# EAGLE design DTUnodeSchematic (EAGLE 8.0.0)

## Sheet 1 of 4
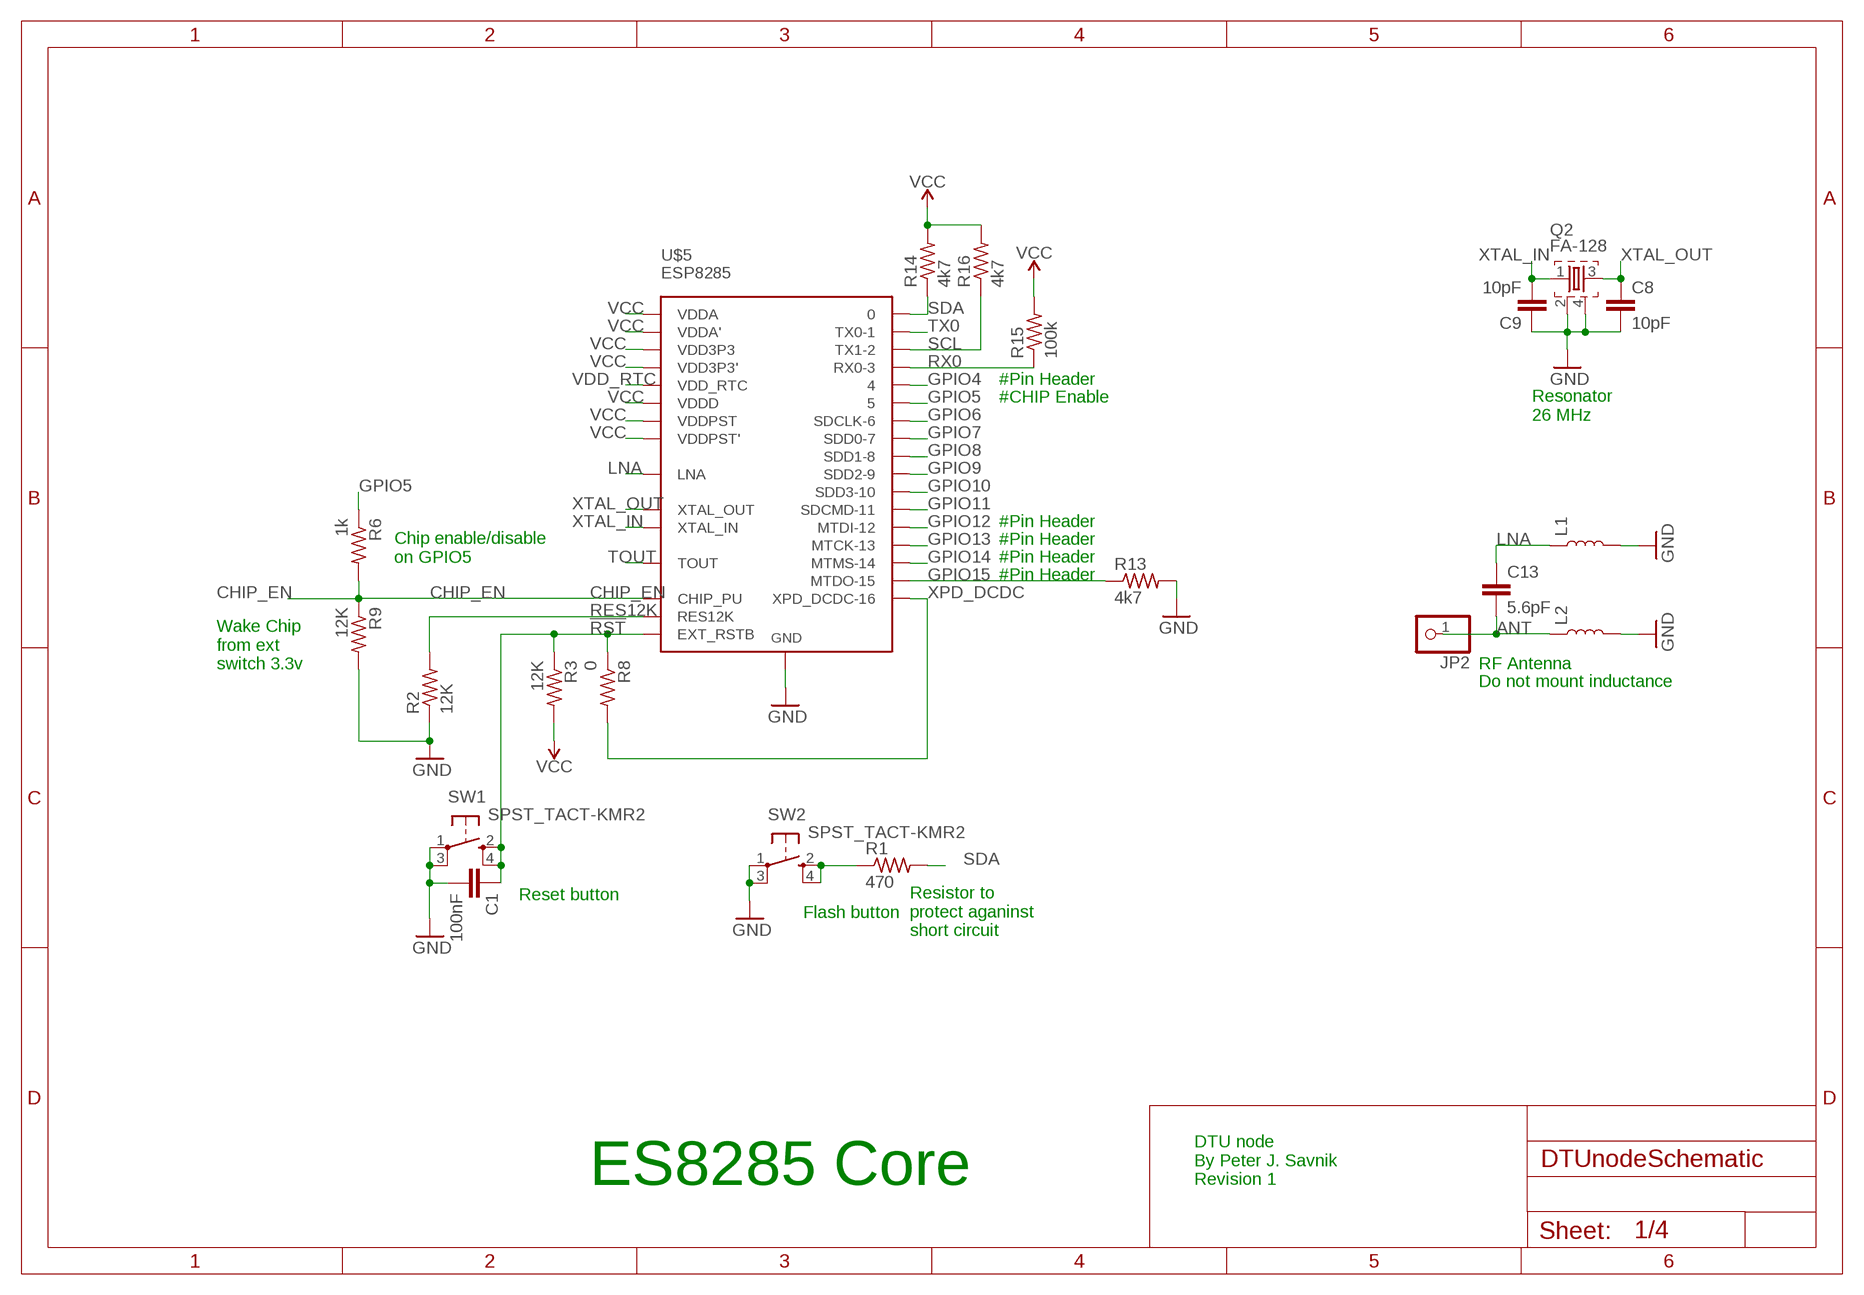
[diagram p0: schematic, sheet 1]

### Parts
C1  100nF  C-EUC0402K  [C0402K]
C8  10pF  C-EUC0402K  [C0402K]
C9  10pF  C-EUC0402K  [C0402K]
C13  5.6pF  C-EUC0402K  [C0402K]
JP2  PINHD-1X1  [1X01]
L1  INDUCTOR-0402-3.9NH  [0402]
L2  INDUCTOR-0402-3.9NH  [0402]
Q2  FA-128  [FA-128]
R1  470  R-US_R0402  [R0402]
R2  12K  R-US_R0402  [R0402]
R3  12K  R-US_R0402  [R0402]
R6  1k  R-US_R0402  [R0402]
R8  0  R-US_R0402  [R0402]
R9  12K  R-US_R0402  [R0402]
R13  4k7  R-US_R0402  [R0402]
R14  4k7  R-US_R0402  [R0402]
R15  100k  R-US_R0402  [R0402]
R16  4k7  R-US_R0402  [R0402]
SW1  SPST_TACT-KMR2  [KMR2]
SW2  SPST_TACT-KMR2  [KMR2]
U$5  ESP8285  [QFN-32]

### Nets
!RST: C1.1 R3.1 R8.1 SW1.2(S) SW1.4(S1) U$5.P$32(EXT_RSTB)
ANT: C13.2 JP2.1 L2.1
CHIP_EN: R6.2 R9.1 U$5.P$7(CHIP_PU) ; also sheet 4
GND: C1.2 C8.2 C9.1 L1.2 L2.2 Q2.2 Q2.4 R2.1 R9.2 R13.2 SW1.1(P) SW1.3(P1) SW2.1(P) SW2.3(P1) U$5.33-GND(GND) ; also sheet 2,3,4
GPIO4: U$5.P$16 ; also sheet 4
GPIO5: R6.1 U$5.P$24
GPIO6: U$5.P$21(SDCLK-6)
GPIO7: U$5.P$22(SDD0-7)
GPIO8: U$5.P$23(SDD1-8)
GPIO9: U$5.P$18(SDD2-9)
GPIO10: U$5.P$19(SDD3-10)
GPIO11: U$5.P$20(SDCMD-11)
GPIO12: U$5.P$10(MTDI-12) ; also sheet 4
GPIO13: U$5.P$12(MTCK-13) ; also sheet 4
GPIO14: U$5.P$9(MTMS-14) ; also sheet 4
GPIO15: R13.1 U$5.P$13(MTDO-15) ; also sheet 4
LNA: C13.1 L1.1 U$5.P$2(LNA)
N$1: R1.1 SW2.2(S) SW2.4(S1)
RES12K: R2.2 U$5.P$31(RES12K)
RX0: R15.1 U$5.P$25(RX0-3) ; also sheet 4
SCL: R16.1 U$5.P$14(TX1-2) ; also sheet 3,4
SDA: R1.2 R14.1 U$5.P$15 ; also sheet 3,4
TOUT: U$5.P$6(TOUT) ; also sheet 2
TX0: U$5.P$26(TX0-1) ; also sheet 4
VCC: R3.2 R14.2 R15.2 R16.2 U$5.P$1(VDDA) U$5.P$3(VDD3P3) U$5.P$4(VDD3P3') U$5.P$11(VDDPST) U$5.P$17(VDDPST') U$5.P$29(VDDD) U$5.P$30(VDDA') ; also sheet 2,3,4
VDD_RTC: U$5.P$5(VDD_RTC)
XPD_DCDC: R8.2 U$5.P$8(XPD_DCDC-16)
XTAL_IN: C9.2 Q2.1 U$5.P$28(XTAL_IN)
XTAL_OUT: C8.1 Q2.3 U$5.P$27(XTAL_OUT)

### Notes on the sheet
- #Pin Header
- #CHIP Enable
- Resonator
  26 MHz
- #Pin Header
- #Pin Header
- Chip enable/disable
  on GPIO5
- #Pin Header
- #Pin Header
- Wake Chip 
  from ext
  switch 3.3v
- RF Antenna
- Do not mount inductance
- Reset button
- Flash button
- Resistor to 
  protect aganinst
  short circuit
- ES8285 Core
- DTU node
  By Peter J. Savnik
  Revision 1

## Sheet 2 of 4
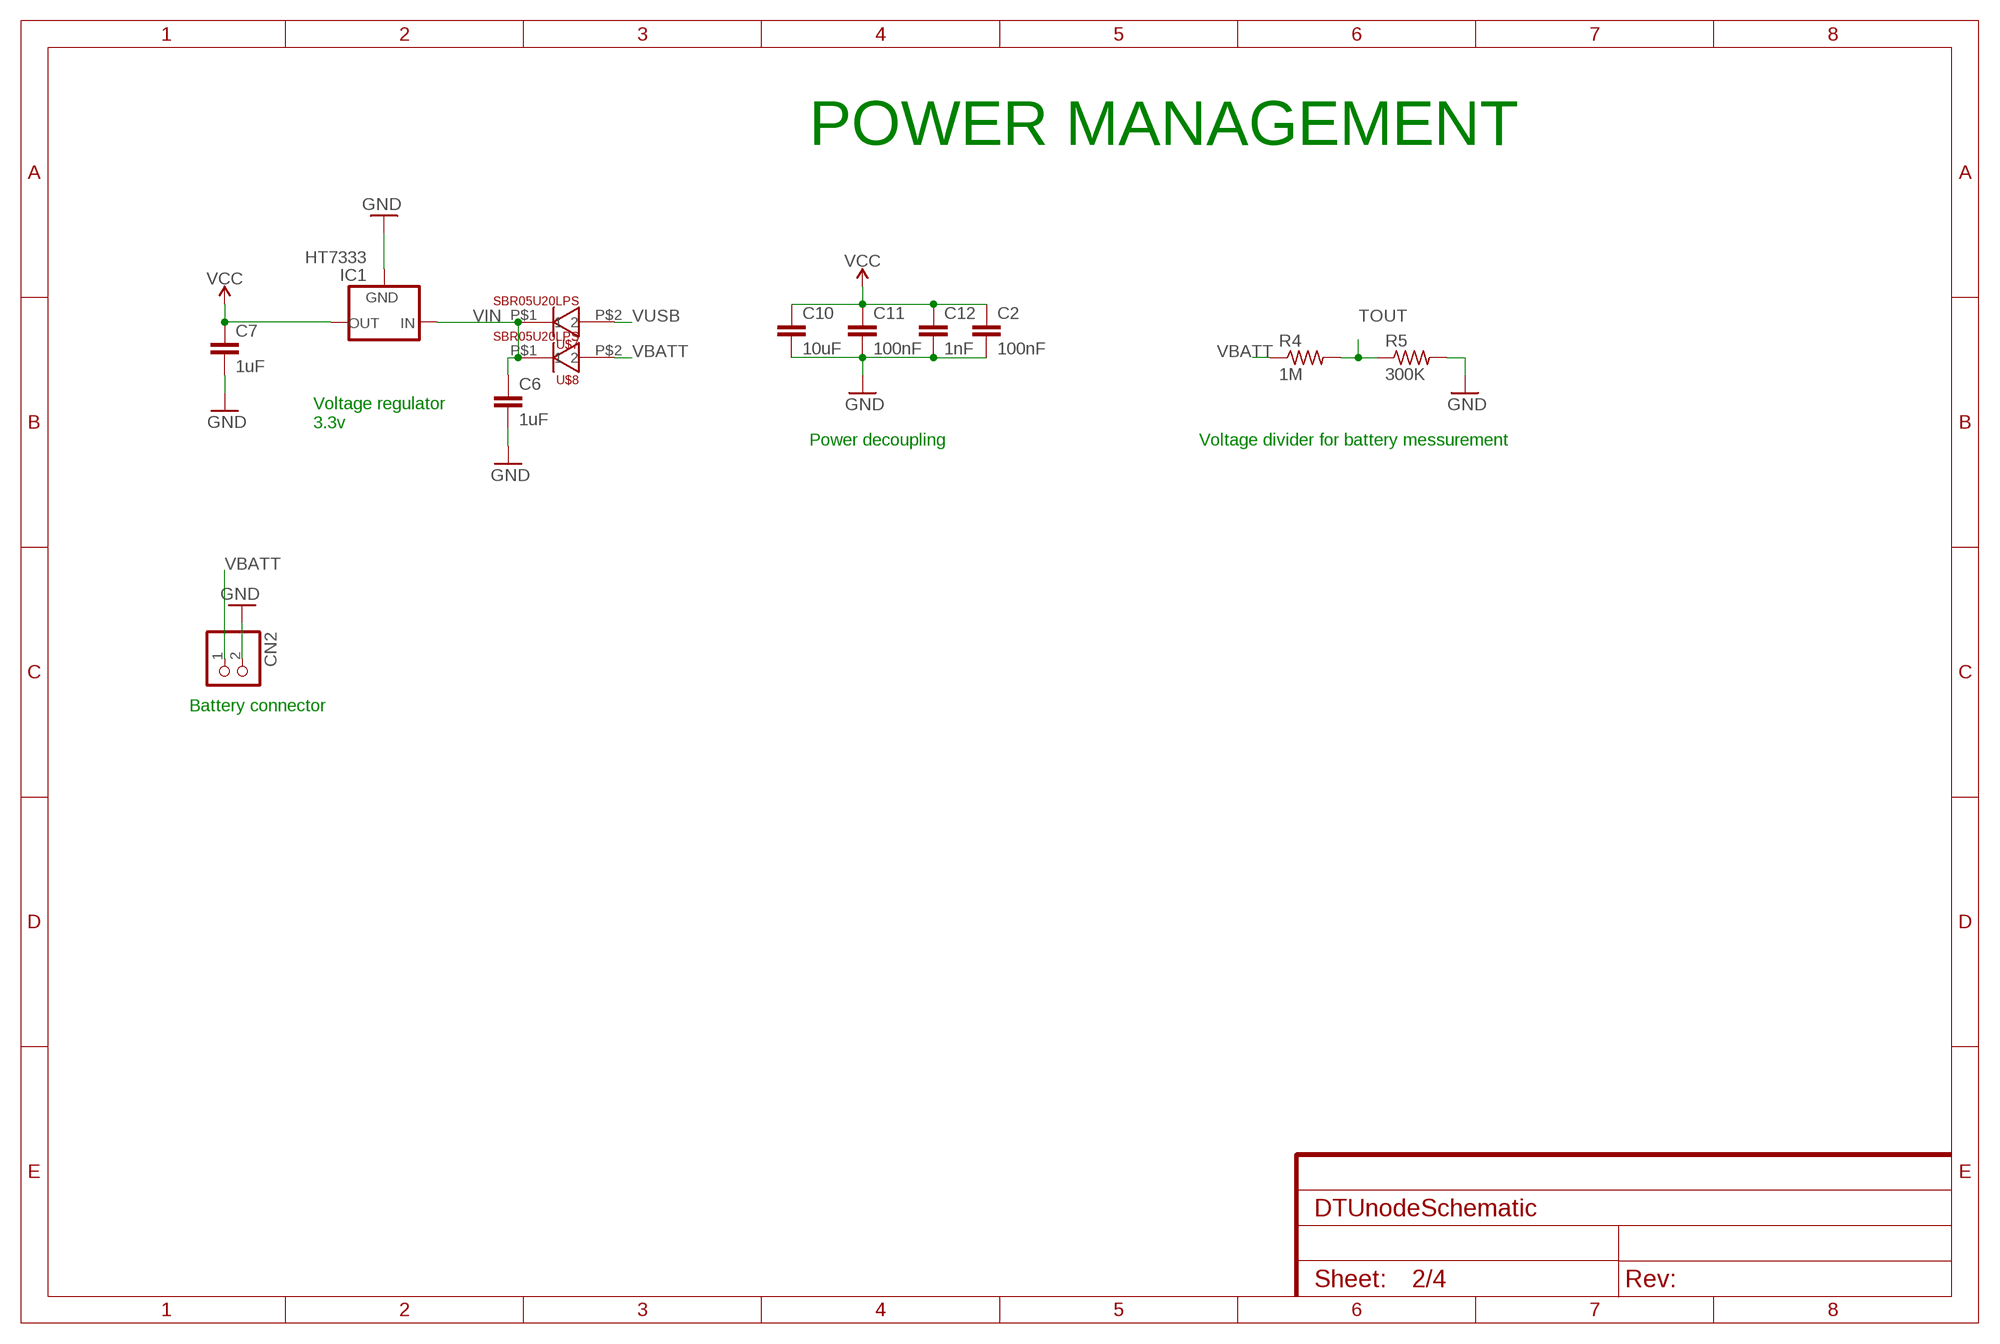
[diagram p1: schematic, sheet 2]

### Parts
C2  100nF  C-EUC0402K  [C0402K]
C6  1uF  C-EUC0402K  [C0402K]
C7  1uF  C-EUC0402K  [C0402K]
C10  10uF  C-EUC0402K  [C0402K]
C11  100nF  C-EUC0402K  [C0402K]
C12  1nF  C-EUC0402K  [C0402K]
CN2  JST_2PIN-THM-RA  [JST-PH-2-THM-RA]
IC1  HT7333  [SOT-89]
R4  1M  R-US_R0402  [R0402]
R5  300K  R-US_R0402  [R0402]
U$7  SBR05U20LPS  [X2-DFN1006-2]
U$8  SBR05U20LPS  [X2-DFN1006-2]

### Nets
GND: C2.2 C6.2 C7.2 C10.2 C11.2 C12.2 CN2.2 IC1.2(GND) R5.2 ; also sheet 1,3,4
TOUT: R4.2 R5.1 ; also sheet 1
VBATT: CN2.1 R4.1 U$8.P$2 ; also sheet 4
VCC: C2.1 C7.1 C10.1 C11.1 C12.1 IC1.1(OUT) ; also sheet 1,3,4
VIN: C6.1 IC1.3(IN) IC1.4(IN) U$7.P$1 U$8.P$1
VUSB: U$7.P$2 ; also sheet 4

### Notes on the sheet
- POWER MANAGEMENT
- Voltage regulator
  3.3v
- Power decoupling | Voltage divider for battery messurement
- Battery connector

## Sheet 3 of 4
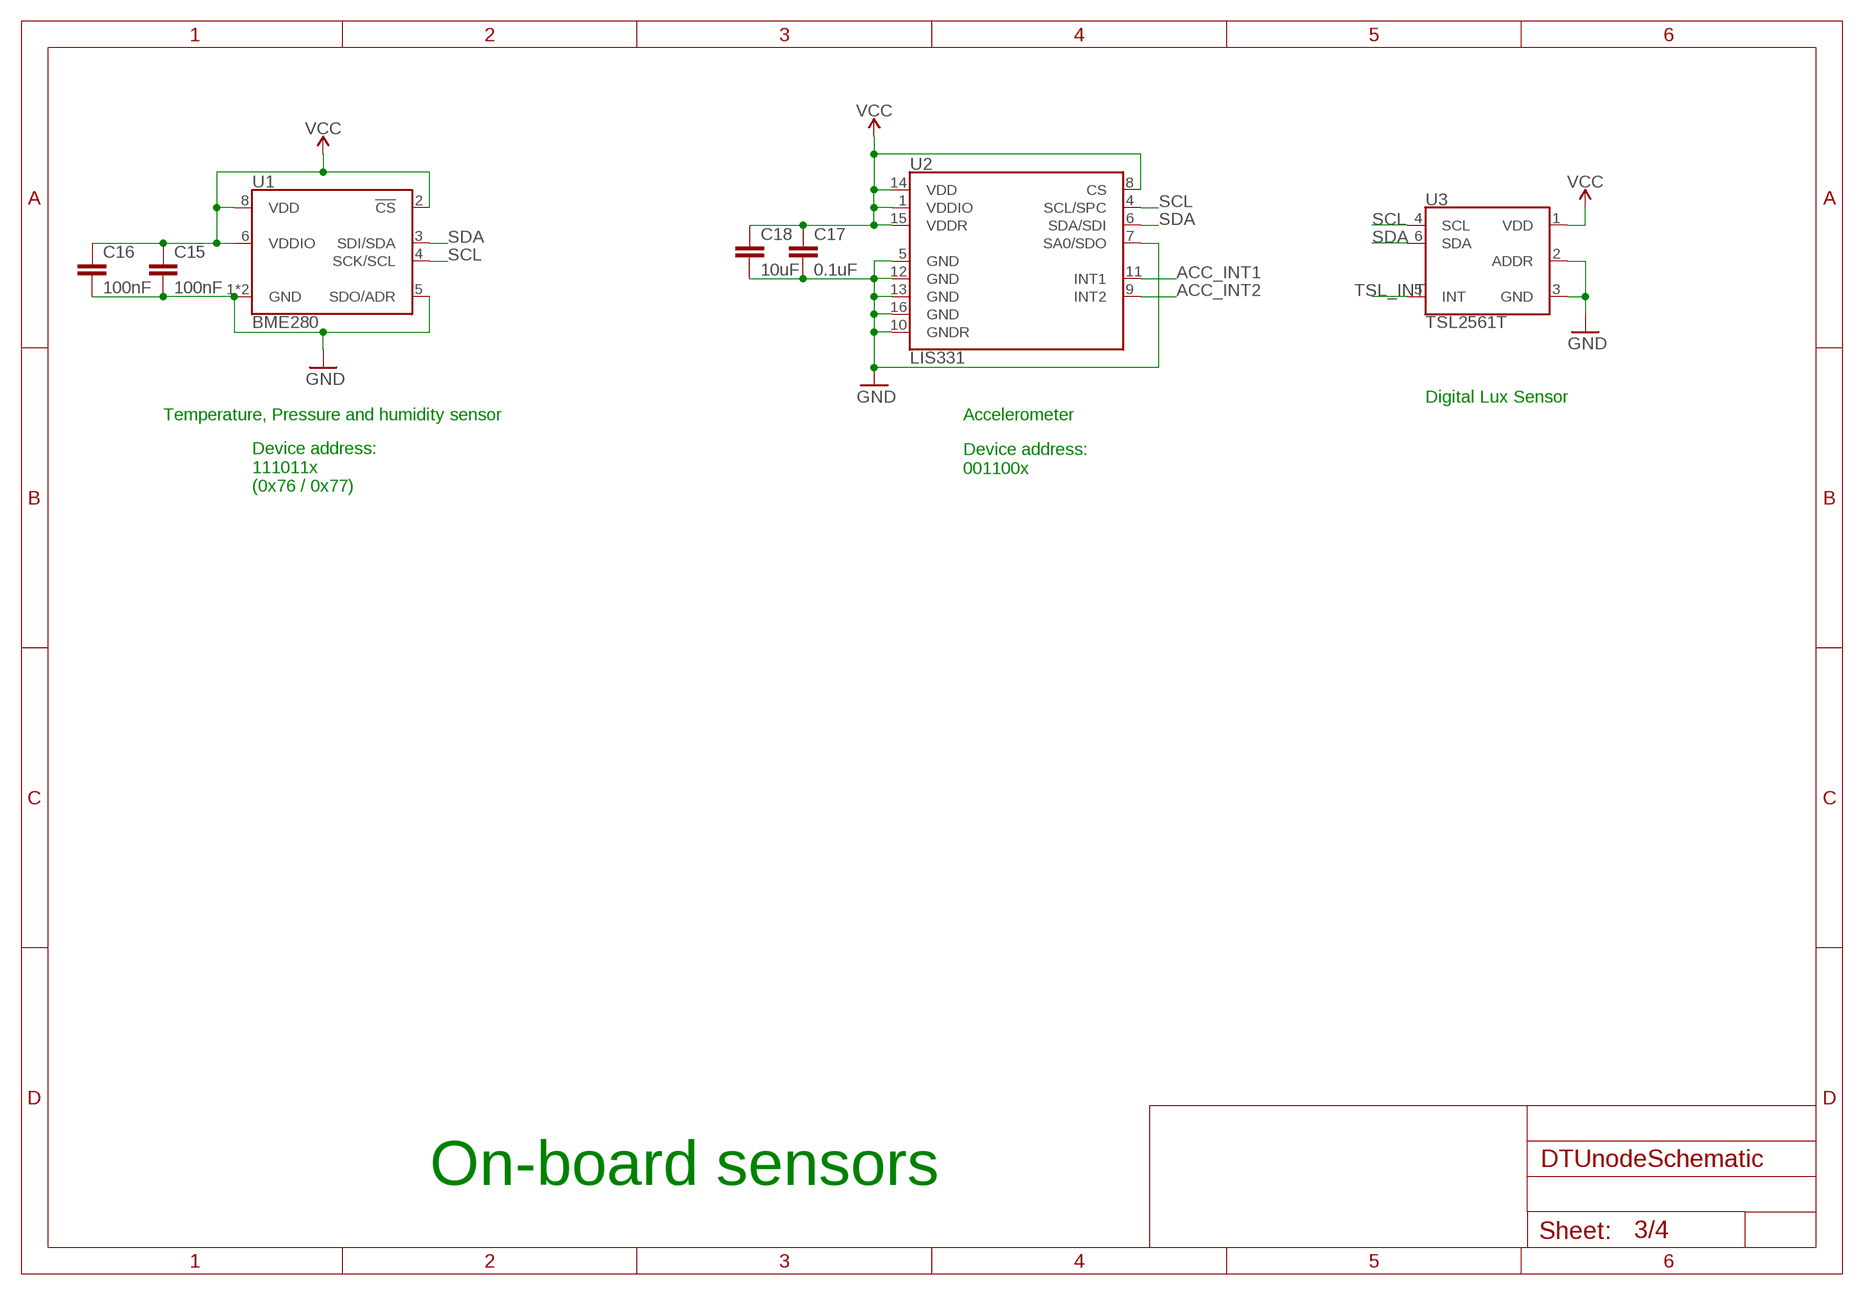
[diagram p2: schematic, sheet 3]

### Parts
C15  100nF  C-EUC0402  [C0402]
C16  100nF  C-EUC0402  [C0402]
C17  0.1uF  C-EUC0402  [C0402]
C18  10uF  C-EUC0402  [C0402]
U1  BME280  [LGA-8-2.5X2.5]
U2  LIS331  [LGA-16-3X3]
U3  TSL2561T  [TMB-6]

### Nets
ACC_INT1: U2.11(INT1)
ACC_INT2: U2.9(INT2)
GND: C15.2 C16.2 C17.2 C18.2 U1.1(GND) U1.5(SDO/ADR) U1.7(GND) U2.5(GND) U2.7(SA0/SDO) U2.10(GNDR) U2.12(GND) U2.13(GND) U2.16(GND) U3.2(ADDR) U3.3(GND) ; also sheet 1,2,4
SCL: U1.4(SCK/SCL) U2.4(SCL/SPC) U3.4(SCL) ; also sheet 1,4
SDA: U1.3(SDI/SDA) U2.6(SDA/SDI) U3.6(SDA) ; also sheet 1,4
TSL_INT: U3.5(INT)
VCC: C15.1 C16.1 C17.1 C18.1 U1.2(!CS) U1.6(VDDIO) U1.8(VDD) U2.1(VDDIO) U2.8(CS) U2.14(VDD) U2.15(VDDR) U3.1(VDD) ; also sheet 1,2,4

### Notes on the sheet
- Digital Lux Sensor
- Temperature, Pressure and humidity sensor | Accelerometer
- Device address:
  001100x
- Device address:
  111011x
  (0x76 / 0x77)
- On-board sensors

## Sheet 4 of 4
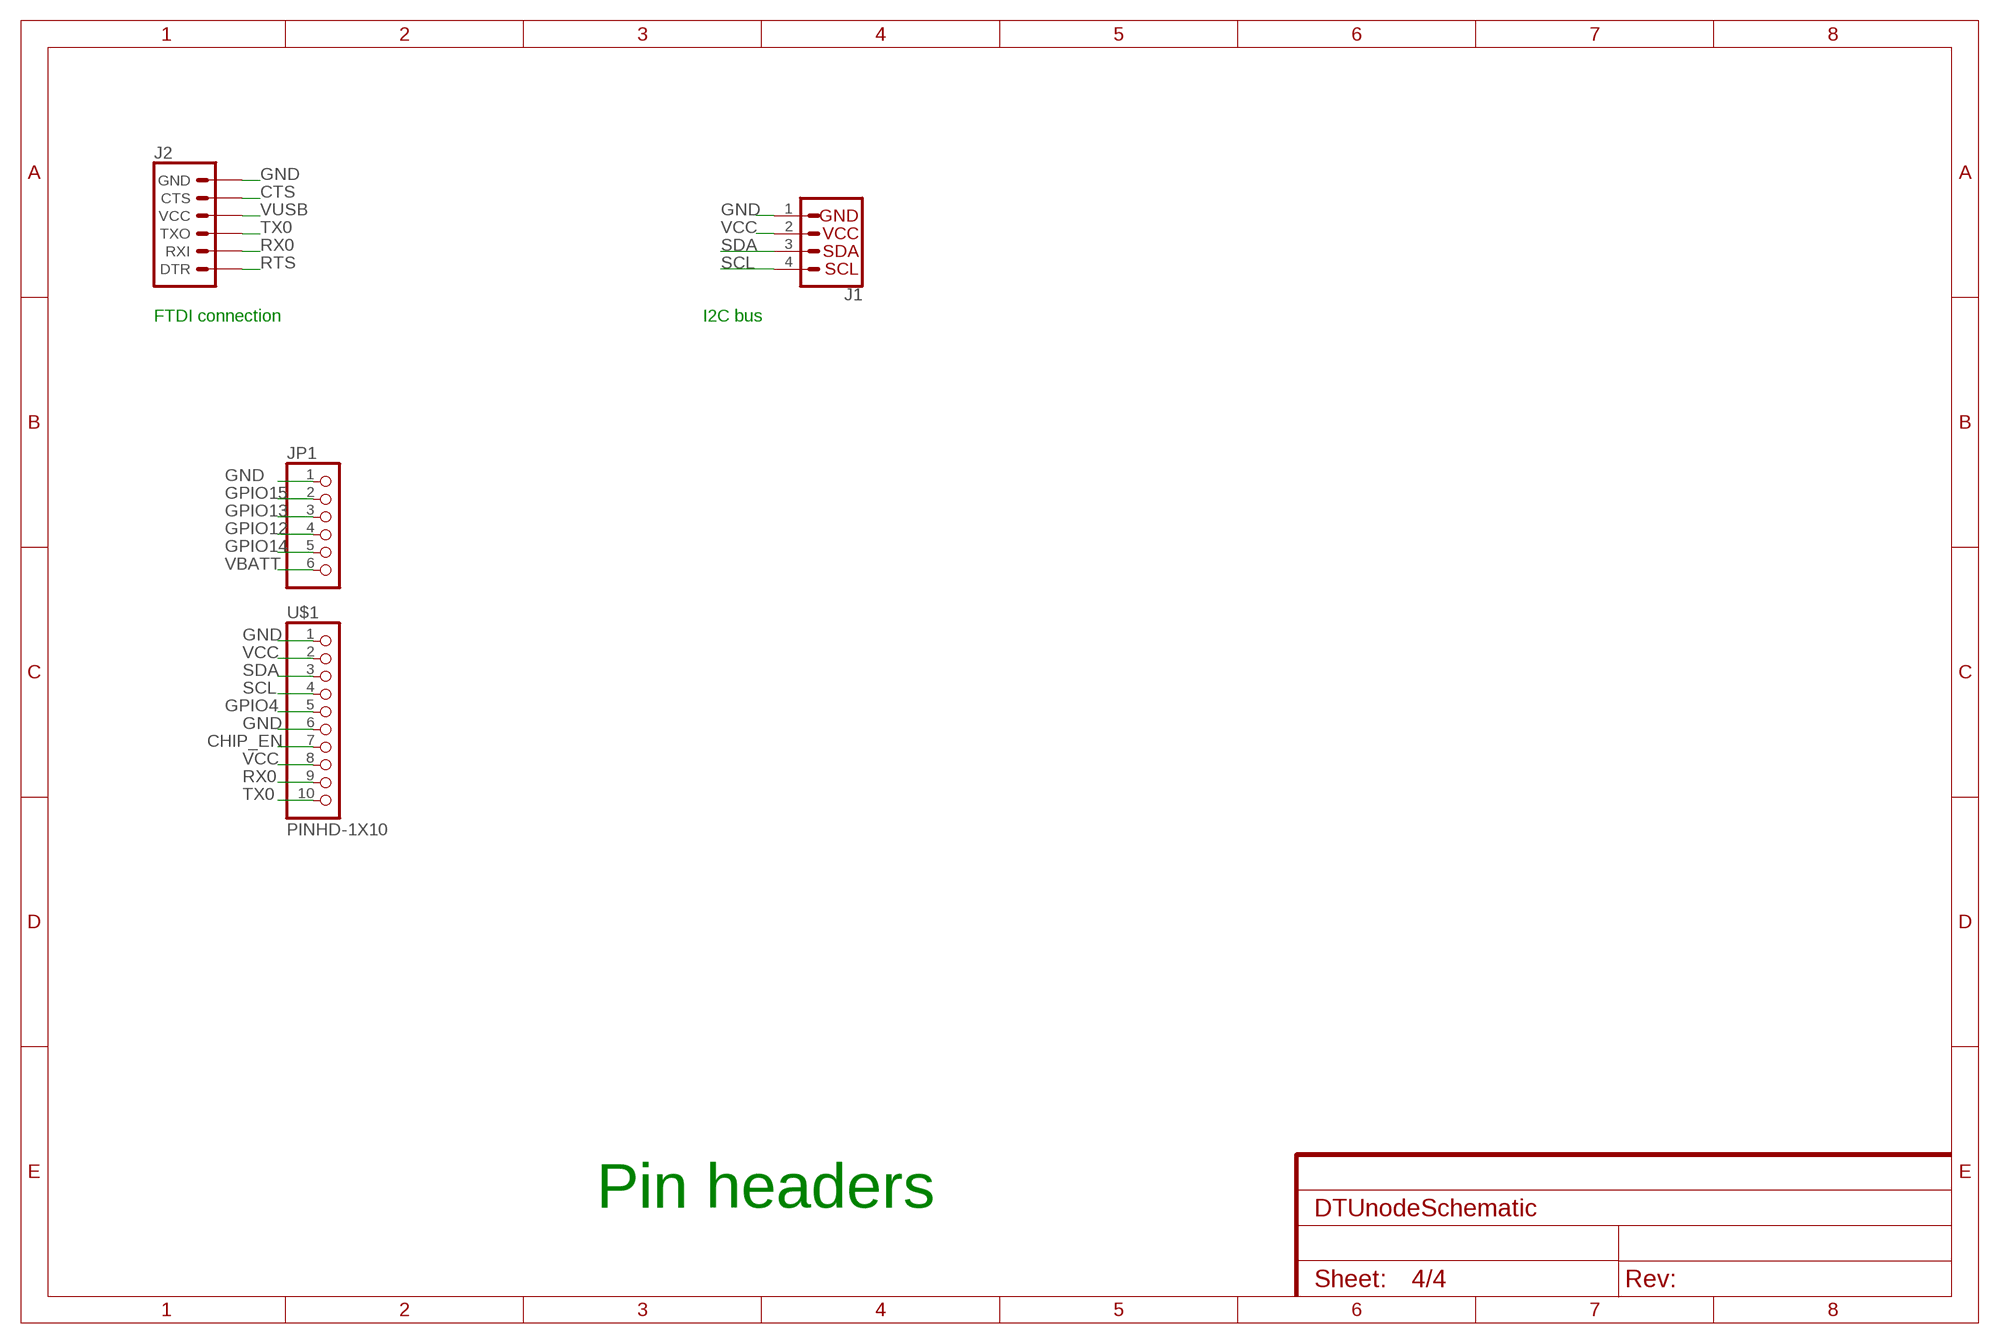
[diagram p3: schematic, sheet 4]

### Parts
J1  I2C_STANDARD  [1X04]
J2  6_PIN_SERIAL_TARGET  [1X06]
JP1  PINHD-1X6  [1X06]
U$1  PINHD-1X10  [1X10-BIG]

### Nets
CHIP_EN: U$1.7 ; also sheet 1
CTS: J2.5(CTS)
GND: J1.1 J2.6(GND) JP1.1 U$1.1 U$1.6 ; also sheet 1,2,3
GPIO4: U$1.5 ; also sheet 1
GPIO12: JP1.4 ; also sheet 1
GPIO13: JP1.3 ; also sheet 1
GPIO14: JP1.5 ; also sheet 1
GPIO15: JP1.2 ; also sheet 1
RTS: J2.1(DTR)
RX0: J2.2(RXI) U$1.9 ; also sheet 1
SCL: J1.4 U$1.4 ; also sheet 1,3
SDA: J1.3 U$1.3 ; also sheet 1,3
TX0: J2.3(TXO) U$1.10 ; also sheet 1
VBATT: JP1.6 ; also sheet 2
VCC: J1.2 U$1.2 U$1.8 ; also sheet 1,2,3
VUSB: J2.4(VCC) ; also sheet 2

### Notes on the sheet
- FTDI connection | I2C bus
- Pin headers

## Library data of the parts
C1 C2 C6-C13 = resistor:C-EU: CAPACITOR, European symbol; OC_FARNELL: unknown
C15-C18 = resistor:C-EU: CAPACITOR, European symbol
CN2 = adafruit:JST_2PIN: JST 2-Pin Connectors of various flavors SMT-RA (S2B-PH-SM4) 4UConnector #17311 SMT (B2B-PH-SM4) THM-RA (S2B-PH) THM (B2B-PH); OC_FARNELL: unknown
IC1 = holtek2:HT73*
J1 = SparkFun-Connectors:I2C_STANDARD: SparkFun I2C Standard Pinout Header SparkFun has standardized on a pinout for all I2C based sensor breakouts. This pinout allows I2C boards to be plugged directly into the headers on Arduino Uno compatible boards, and to be daisy chained easily. Example SparkFun Products: SparkFun Atmospheric Sensor Breakout - BME280 <https://www.sparkfun.com/products/13676> SparkFun Altitude/Pressure Sensor Breakout - MPL3115A2 <https://www.sparkfun.com/products/11084> SparkFun TOF Range Finder Sensor - VL6180 <https://www.sparkfun.com/products/12785>
J2 = SparkFun-Connectors:6_PIN_SERIAL_TARGET: 6-pin header connection for use with the "FTDI BASIC" pinout - TARGET SIDE. Also known as "Arduino Serial Program Header". It is used to mate with our FTDI Basic serial programmers using the Arduino IDE. Note, this device has "TARGET" in the name. It is intended to be used on a design that contains a target micro-controller that you wish to program. The "sister" device, named "CABLE" is inteneded to be used on a design that usually lives on the end of your USB cable and prvides the converter chip (FTDI232 or FTDI231x) to commnicate serial RX/TX. You can populate with some of these: Break Away Headers - Straight <https://www.sparkfun.com/products/116> (PRT-00116) For reference (or to suit your programming needs) check out these designs: SparkFun FTDI Basic Breakout - 5V <https://www.sparkfun.com/products/9716> (DEV-09716) SparkFun FTDI Basic Breakout - 3.3V <https://www.sparkfun.com/products/9873> (DEV-09873) SparkFun FTDI SmartBasic <https://www.sparkfun.com/products/12935> (DEV-12935) SparkFun Beefy 3 - FTDI Basic Breakout <https://www.sparkfun.com/products/13746> (DEV-13746)
JP1 = adafruit:PINHD-1X6: PIN HEADER
JP2 = adafruit:PINHD-1X1: Pin header 1x1 for 0.1" spacing With round pins; OC_FARNELL: unknown
L1 L2 = SparkFun-Coils:INDUCTOR: Inductors Resist changes in electrical current. Basically a coil of wire. SparkFun Products: SparkFun Load Cell Amplifier - HX711 <https://www.sparkfun.com/products/13879> IOIO-OTG - V2.2 <https://www.sparkfun.com/products/13613>; OC_FARNELL: unknown; PROD_ID: NDUC-13457; VALUE: 3.9NH
Q2 = crystal:FA-: MHz RANGE CRYSTAL UNIT Source: Epson Toyocom; OC_FARNELL: unknown
R1-R6 R8 R9 R13-R16 = resistor:R-US_: RESISTOR, American symbol; OC_FARNELL: unknown
SW1 SW2 = adafruit:SPST_TACT: SMT 6mm switch, EVQQ2 series http://www.ladyada.net/library/eagle
U1 = SparkFun-Sensors:BME280: Bosch BME280 – Combined Humidity and Pressure Sensor The BME280 is as combined digital humidity, pressure and temperature sensor based on proven sensing principles. The sensor module is housed in an extremely compact metal-lid LGA package with a footprint of only 2.5×2.5mm² with a height of 0.93mm. Its small dimensions and its low power consumption allow the implementation in battery driven devices such as handsets, GPS modules or watches. Datasheet <https://cdn.sparkfun.com/assets/learn_tutorials/4/1/9/BST-BME280_DS001-10.pdf> SparkFun Products SparkFun Atmospheric Sensor Breakout - BME280 <https://www.sparkfun.com/products/13676> (SEN-13676); PROD_ID: IC-13090
U2 = SparkFun-Sensors:LIS331: ST Microelectronics LIS331 3-Axis ±6/12/24g SPI/I2C Accelerometer The LIS331HH is an ultra low-power full-scale three axis MEMS linear accelerometer. It has a digital I2C/SPI serial interface which makes it ideal for using in embedded applications. The device also features ultra low-power operational modes that allow advanced power saving and smart sleep to wake-up functions. Datasheet <http://www.sparkfun.com/datasheets/Sensors/Accelerometer/LIS331HH.pdf> SparkFun Products SparkFun Triple Axis Accelerometer Breakout - LIS331 <https://www.sparkfun.com/products/10345> (SEN-10345) Triple Axis Accelerometer - LIS331HH <https://www.sparkfun.com/products/9755> (SEN-09755); PROD_ID: IC-12675; SF_ID: COM-09755
U3 = SparkFun-Sensors:TSL2561: TAOS TSL2561 Digital Luminosity (Light) Sensor The TSL2561 is a light-to-digital converter that transform light intensity to a digital signal output via I2C interface. The device combines one broadband photodiode (visible plus infrared) and one infrared-responding photodiode on a single CMOS integrated circuit capable of providing a near-photopic response over an effective 20-bit dynamic range (16-bit resolution). Two integrating ADCs convert the photodiode currents to a digital output that represents the irradiance measured on each channel. This digital output can be input to a microprocessor where illuminance (ambient light level) in lux is derived using an empirical formula to approximate the human eye response. The TSL2561 device supports a traditional level style interrupt that remains asserted until the firmware clears it. Datasheet <http://www.mouser.com/ds/2/588/ams_sl2560-e58-488842.pdf> SparkFun Products SparkFun Luminosity Sensor Breakout - TSL2561 <https://www.sparkfun.com/products/12055> (SEN-12055)
U$1 = adafruit:PINHD-1X10: Pin header 1x10 0.1" spacing With round pins
U$5 = Ma-ESP8285:ESP8285: ESP8285 Microcontroller with wifi and 1M flash by Espressif; OC_FARNELL: unknown
U$7 U$8 = Diodes_Inc_By_element14_Batch_1:SBR05U20LPS: SURFACE MOUNT SUPER BARRIER RECTIFIER Ultra-Low Forward Voltage Drop Superior Reverse Avalanche Capability Patented Super Barrier Rectifier Technology Soft, Fast Switching Capability +150°C Operating Junction Temperature Totally Lead-Free & Fully RoHS Compliant (Notes 1 & 2) Halogen and Antimony Free. “Green” Device (Note 3); OC_FARNELL: unknown

## Board
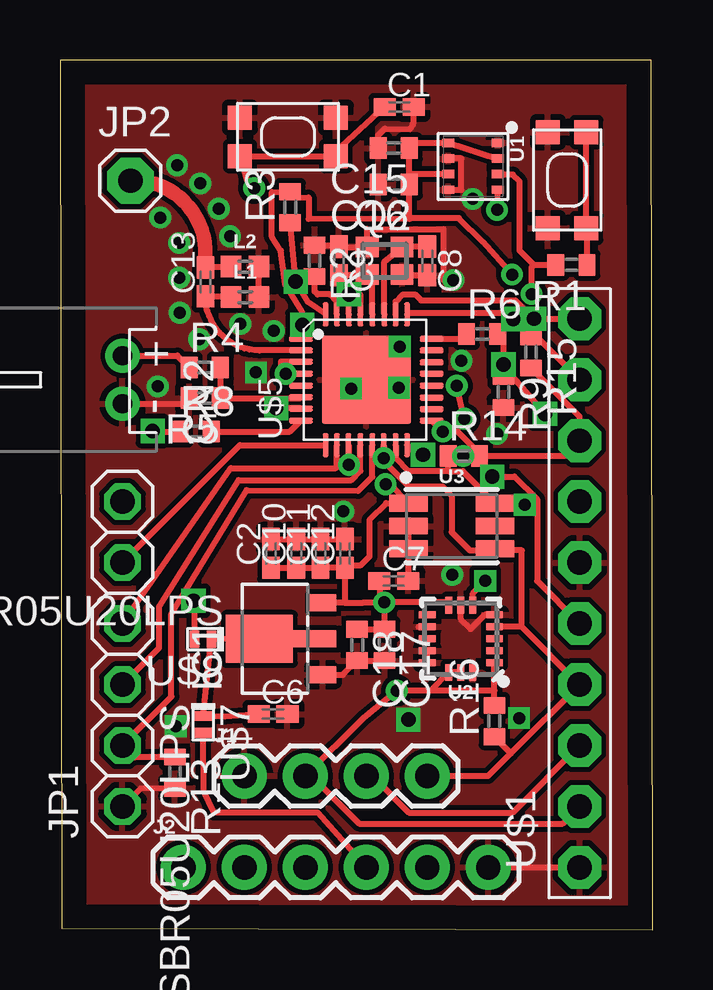
[diagram p4: board, top side]
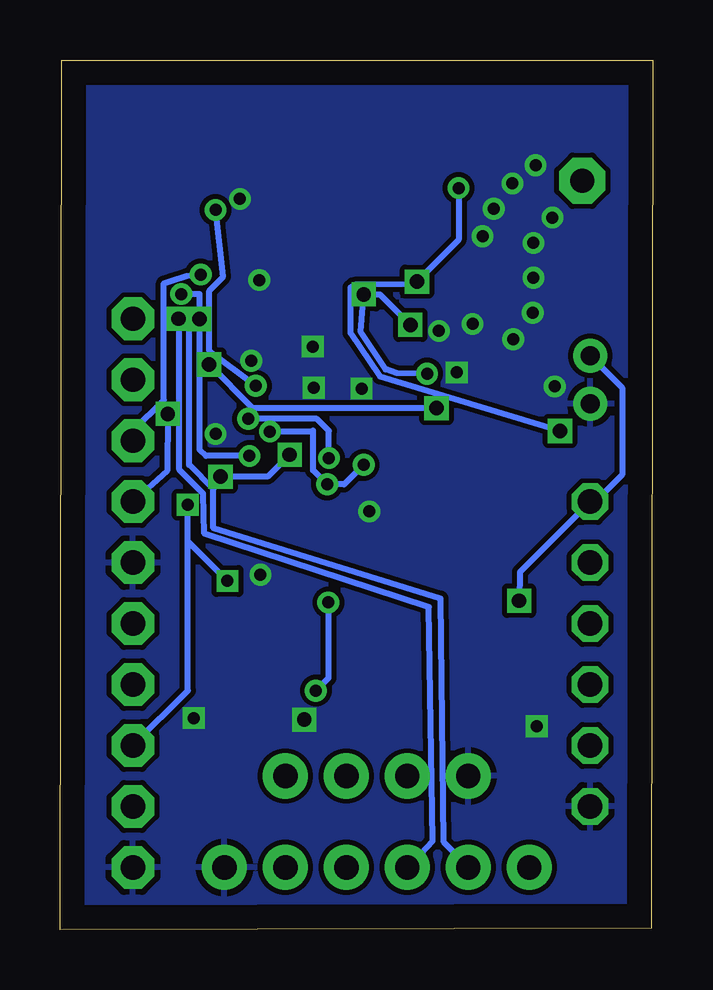
[diagram p5: board, bottom side, seen from below]

Size 24.69 x 36.23 mm. Coordinates in mm from the lower left corner, seen from the top.
Outline: 0.06,0.05 24.69,0 24.63,36.23 0,36.23 0.06,0.05
Copper layers (1*16): Top 0.035mm / dielectric 1.5mm / Bottom 0.035mm
Design rules "default": minimum track width 10mil, minimum drill 24mil, track to track 8mil, track to pad 8mil, pad to pad 8mil, via to via 8mil, smd to smd 8mil, copper to edge 40mil, drill to drill 8mil, minimum pad ring 10mil, minimum via ring 8mil, stop-mask expansion 4mil, vias tented up to drill 0mil, thermal gap 10mil

### Footprints (pad centres in the part's own frame; a part is rotated, then mirrored left to right if it is on the bottom)
C0402K = smd 0.925 x 0.74: 1 -0.6,0; 2 0.6,0
C0402 = smd 0.7 x 0.9: 1 -0.65,0; 2 0.65,0
JST-PH-2-THM-RA = drill 0.8 pad 1.422: 1 1,0; 2 -1,0
SOT-89 = smd 0.7 x 1.1: 1 1.5,-2.385; 2 -1.5,-2.385 | smd 0.7 x 1.8: 3 0,-2.035 | smd 2 x 2.8: 4 0,0.265
1X04 = drill 1.016 pad 1.88: 1 0,0; 2 2.54,0; 3 5.08,0; 4 7.62,0
1X06 = drill 1.016 pad 1.88: 1 0,0; 2 2.54,0; 3 5.08,0; 4 7.62,0; 5 10.16,0; 6 12.7,0
1X06' = drill 1.016 octagon: 1 -6.35,0; 2 -3.81,0; 3 -1.27,0; 4 1.27,0; 5 3.81,0; 6 6.35,0
1X01 = drill 1.016 pad 1.93 octagon: 1 0,0
0402 = smd 0.85 x 0.9: 1 -0.58,0; 2 0.58,0
FA-128 = smd 0.95 x 0.85: 1 -0.725,-0.575; 2 0.725,-0.575; 3 0.725,0.575; 4 -0.725,0.575
R0402 = smd 0.7 x 0.9: 1 -0.65,0; 2 0.65,0
KMR2 = smd 1 x 1: 1 2,0.8; 2 2,-0.8; 3 -2,0.8; 4 -2,-0.8
LGA-8-2.5X2.5 = smd 0.35 x 0.5: 1 -0.975,1.025; 2 -0.325,1.025; 3 0.325,1.025; 4 0.975,1.025; 5 0.975,-1.025; 6 0.325,-1.025; 7 -0.325,-1.025; 8 -0.975,-1.025
LGA-16-3X3 = smd 0.7 x 0.28: 1 -1.4,1; 2 -1.4,0.5; 3 -1.4,0; 4 -1.4,-0.5; 5 -1.4,-1; 9 1.4,-1; 10 1.4,-0.5; 11 1.4,0; 12 1.4,0.5; 13 1.4,1 | smd 0.28 x 0.7: 6 -0.5,-1.4; 7 0,-1.4; 8 0.5,-1.4; 14 0.5,1.4; 15 0,1.4; 16 -0.5,1.4
TMB-6 = smd 1.6 x 0.7: 1 -1.8,0.95; 2 -1.8,0; 3 -1.8,-0.95; 4 1.8,-0.95; 5 1.8,0; 6 1.8,0.95
1X10-BIG = drill 1.016 pad 1.778 octagon: 1 -11.43,0; 2 -8.89,0; 3 -6.35,0; 4 -3.81,0; 5 -1.27,0; 6 1.27,0; 7 3.81,0; 8 6.35,0; 9 8.89,0; 10 11.43,0
QFN-32 = smd 3.7 x 3.7: 33-GND 0,0 | smd 0.25 x 1: P$1 1.7,2.725; P$2 1.225,2.725; P$3 0.75,2.725; P$4 0.25,2.725; P$5 -0.25,2.725; P$6 -0.725,2.725; P$7 -1.2,2.725; P$8 -1.7,2.725; P$17 -1.7,-2.725; P$18 -1.225,-2.725; P$19 -0.75,-2.725; P$20 -0.25,-2.725; P$21 0.25,-2.725; P$22 0.725,-2.725; P$23 1.225,-2.725; P$24 1.7,-2.725 | smd 1 x 0.25: P$9 -2.725,1.7; P$10 -2.725,1.225; P$11 -2.725,0.75; P$12 -2.725,0.25; P$13 -2.725,-0.25; P$14 -2.725,-0.725; P$15 -2.725,-1.225; P$16 -2.725,-1.7; P$25 2.725,-1.7; P$26 2.725,-1.225; P$27 2.725,-0.75; P$28 2.725,-0.25; P$29 2.725,0.25; P$30 2.725,0.725; P$31 2.725,1.225; P$32 2.725,1.7
X2-DFN1006-2 = smd 0.4 x 0.7: P$1 0,0; P$2 0.7,0

### Placement (x,y rotation side)
C1  14.14,34.28 0 top
C2  8.79,15.67 90 top
C6  8.88,8.98 0 top
C7  13.91,14.53 0 top
C8  15.3,27.86 270 top
C9  11.62,27.86 270 top
C10  9.84,15.67 90 top
C11  10.86,15.67 90 top
C12  11.87,15.67 90 top
C13  6.06,26.99 90 top
C15  13.91,32.56 180 top
C16  13.91,31.04 180 top
C17  13.53,11.86 270 top
C18  12.38,11.86 270 top
CN2  2.6,22.91 90 top
IC1  8.57,12.12 90 top
J1  7.68,6.4 0 top
J2  5.14,2.59 0 top
JP1  [1X06']  2.6,11.48 90 top
JP2  2.93,31.2 0 top
L1  7.71,26.35 0 top
L2  7.71,27.62 0 top
Q2  13.53,27.86 0 top
R1  21.31,27.7 180 top
R2  10.6,27.86 270 top
R3  9.59,30.1 90 top
R4  6.03,23.42 0 top
R5  6.03,22.15 180 top
R6  17.59,24.82 0 top
R8  5.65,20.75 0 top
R9  18.48,22.4 270 top
R13  4.79,6.54 270 top
R14  16.83,19.74 0 top
R15  19.62,24.05 270 top
R16  18.1,8.69 90 top
SW1  9.5,33.03 0 top
SW2  21.13,31.23 90 top
U1  17.21,31.8 270 top
U2  16.7,12.12 180 top
U3  16.32,16.81 0 top
U$1  21.65,14.02 90 top
U$5  12.76,22.91 90 top
U$7  5.97,8.9 270 top
U$8  6.31,12.1 180 top

### Tracks (layer width: path | path; a pad name or v marks a point on that pad's centre or on a via)
!RST  (via drill 0.5 pad 0.25, 0.6)
  Top 0.254: v9.82,27.01 R3.1 | v9.82,27.01 v9.82,27 | v3.86,20.78 3.89,20.75 R8.1 | U$5.P$32 10.34,26.15 v9.82,27.01 | v8.09,30.9 7.8,31.18 SW1.4 SW1.2 11.5,32.41 C1.1
  Bottom 0.254: v9.82,27 9.98,26.9 12.42,26.86 12.6,26.75 12.6,24.87 11.37,23.05 v3.86,20.78 | v8.09,30.9 8.09,28.74 v9.82,27.01
ANT
  Top 0.254: C13.2 6.09,27.62 L2.1
  Top 0.61: C13.2 6.06,28.35 arc90 JP2.1
CHIP_EN  (via drill 0.6)
  Top 0.254: R6.2 18.48,24.58 v18.48,23.55 R9.1 18.84,23.05 v20.21,21.49 | U$5.P$7 10.02,21.73 v9,21.73
  Bottom 0.254: v20.21,21.49 20.23,19.11 U$1.7 | v9,21.73 16.66,21.73 v18.48,23.55
GND  (via drill 0.5, 0.5 pad 0.25, 0.6)
  Top 0.254: Q2.2 14.25,27.26 C8.2 | R2.1 11.57,28.51 C9.1 11.62,28.44 Q2.4 12.8,29.18 15.98,29.18 15.98,27.06 v16.4,27.06 | C12.2 C11.2 C10.2 C2.2 | C17.2 C18.2 11.79,10.62 IC1.2 | U2.10 14.93,12.62 | 15.2,11.21 U2.13 U2.12 | CN2.2 5.14,21.91 R5.2 | R13.2 3.35,5.88 JP1.1 | U1.5 16.73,30.83 16.73,32.13 U1.7 | L1.2 L2.2 | J2.6 U$1.1 | U3.2 U3.3 14.52,14.54 C7.2 | U2.5 17.69,13.12 17.11,12.53 16.7,12.94 U2.7 | C15.2 13.26,33.09 13.54,33.38 14.59,33.35 14.71,33.54 14.74,33.64 C1.2
  other vias: 14.52,8.75 19.13,8.81 4.83,8.47 8.17,23.22 12.13,22.54 14.12,22.58 14.16,24.3 4.88,31.85 5.84,31.09 6.62,30.04 7.09,28.89 4.18,29.67 4.97,28.61 4.97,27.17 4.99,25.7 5.8,24.6 7.51,25.23 8.9,24.94 4.08,22.63 16.34,14.78 18.21,20.65 16.73,23.7 11.81,17.42 17.2,30.44
  pour Bottom: -4.65,-3.68 41.94,-3.68 41.94,43.42 -4.65,43.42
  pour Top: -5.66,45.59 45.14,45.59 45.14,-3.92 -5.66,-3.92
GPIO4  (via drill 0.6)
  Top 0.254: U$5.P$16 14.86,19.79 v15.13,19.79 | v18.01,18.87 18.94,18.87 19.88,17.93 19.88,14.53 U$1.5
  Bottom 0.254: v15.13,19.79 16.04,18.87 v18.01,18.87
GPIO5
  Top 0.254: U$5.P$24 16.73,24.61 R6.1
GPIO12
  Top 0.254: JP1.4 7.12,19.23 11.49,19.23 11.54,19.27 U$5.P$10
GPIO13
  Top 0.254: JP1.3 4.13,11.73 4.13,13.46 7.44,18.73 12.13,18.73 12.51,19.12 U$5.P$12
GPIO14
  Top 0.254: JP1.5 7.5,20.19 U$5.P$9
GPIO15
  Top 0.254: R13.1 3.1,7.18 JP1.2 4.64,9.7 4.64,13.14 7.77,18.31 12.42,18.27 13.01,18.87 U$5.P$13
LNA
  Top 0.254: L1.1 7.09,26.39 C13.1 arc90 8.31,24.14 U$5.P$2
N$1
  Top 0.254: R1.1 21.96,29.2 SW2.4 SW2.2
RES12K
  Top 0.254: U$5.P$31 11.54,26.17 11.24,26.47 10.73,26.47 10.6,26.59 R2.2
RX0  (via drill 0.6)
  Top 0.254: U$5.P$25 14.53,25.7 18.62,25.7 v18.89,25.44 R15.1 19.86,24.7 U$1.9
  Bottom 0.254: J2.2 7.68,2.63 8.7,3.64 8.84,13.79 18.3,16.73 18.3,18.35 19.32,19.37 19.32,25.01 v18.89,25.44
SCL  (via drill 0.5 pad 0.25)
  Top 0.254: v13.49,19.65 U$5.P$14 v13.49,19.65 | v13.49,19.65 13.49,19.52 14.54,18.47 15.94,18.47 16.32,18.08 16.32,16.56 17.08,15.8 18.05,15.8 U3.4 18.12,15.8 19.24,15.8 19.24,12.62 | 19.24,12.62 U2.4 | 19.24,12.62 U$1.4 18.79,7.35 | J1.4 17.84,6.4 18.79,7.35 | R16.1 18.79,7.35 | v16.85,21.28 v16.54,22.66 | v18.21,29.98 U1.4
  Bottom 0.254: v13.49,19.65 13.49,20.78 14,21.28 v16.85,21.28 | v16.54,22.66 18.47,24.1 18.47,26.62 17.89,27.2 v18.21,29.98
SDA  (via drill 0.5, 0.5 pad 0.25)
  Top 0.254: U$5.P$15 13.99,19.65 14.54,19.1 16.18,19.1 | 16.18,19.1 16.78,19.1 U3.6 19.31,17.76 v19.37,17.7 | J1.3 13.02,6.4 14.54,4.88 18.86,4.88 U$1.3 | U2.6 17.2,14.01 v17.72,14.53 | 16.18,19.1 R14.1 v16.8,19.74 | 19.75,27.7 R1.2 | 19.75,27.7 19.15,28.3 19.15,31.18 18.87,31.46 18.25,31.46 U1.3 | v19.65,26.48 19.65,27.6 19.75,27.7
  Bottom 0.254: 19.37,16.18 v17.72,14.53 | 19.37,16.18 v19.37,17.7 | U$1.3 19.37,9.96 19.37,16.18 | v16.8,19.74 18.61,19.74 18.87,20 18.87,26.48 v19.65,26.48
TOUT
  Top 0.254: R4.2 R5.1 10,22.15 U$5.P$6
TX0  (via drill 0.6)
  Top 0.254: U$5.P$26 13.99,26.17 14.29,26.47 14.8,26.47 15.05,26.21 18.99,26.21 v19.75,25.45 U$1.10
  Bottom 0.254: v19.75,25.45 19.72,25.43 19.72,19.15 18.73,18.16 18.68,16.5 9.32,13.44 9.17,3.7 9.92,2.9 J2.3
VBATT  (via drill 0.6)
  Top 0.254: JP1.6 | CN2.1 4.89,23.91 R4.1 | v5.56,13.7 5.61,12.26 U$8.P$2
  Bottom 0.254: CN2.1 1.27,22.58 1.27,18.95 2.39,17.83 JP1.6 5.54,14.9 v5.56,13.7
VCC  (via drill 0.5 pad 0.25, 0.6)
  Top 0.254: U$5.P$30 v12.04,26.47 12.51,26.47 U$5.P$29 | U$5.P$3 9.21,23.66 9.21,23.16 v9.4,23.16 U$5.P$4 | C16.1 C15.1 arc-90 14.77,32.78 U1.8 U1.2 | U1.6 14.56,31.48 C16.1 | U2.15 U2.14 15.44,9.96 | U$1.2 20.94,4.42 12.46,4.42 10.48,6.4 J1.2 12.64,8.81 v14.03,9.96 15.44,9.96 | 13.64,13.63 14.03,13.64 16.08,13.64 U2.8 | v13.51,13.63 13.32,13.63 | v13.51,13.63 13.64,13.63 | 13.32,13.63 12.61,13.62 11.87,13.62 | 11.87,13.62 IC1.1 | U2.1 18.1,9.96 | 18.1,9.96 15.44,9.96 | C12.1 C11.1 C10.1 C2.1 | C12.1 11.87,13.62 | C12.1 11.97,15.16 12.51,15.16 12.89,15.54 12.89,17.07 13.59,17.76 U3.1 13.73,18.55 v13.56,18.55 | v15.95,20.75 16.57,20.75 17.48,19.85 R14.2 21.02,19.74 U$1.8 21.65,21.37 R15.2 | v15.95,20.75 U$5.P$17 | C18.1 C17.1 13.53,13.51 13.64,13.63 | R16.2 18.1,9.96 | C7.1 13.32,14.51 13.32,13.63 | U$5.P$1 10.04,25.14 v10.1,25.2 10.08,25.74 9.39,26.89 9.21,28.3 8.83,28.87 8.83,30.72 R3.2 9.8,30.49 10.36,30.51 10.36,29.62 14.55,29.6 | U$5.P$11 12.04,20.16 v12.04,19.37 | 14.55,29.6 C16.1 | v15.95,20.75 15.95,20.84 | v18.83,27.29 17.61,28.65 16.62,29.64 14.59,29.64 14.55,29.6 | 13.64,13.63 v13.52,13.63 v13.51,13.63
  Bottom 0.254: v10.1,25.2 11.37,26.47 v12.04,26.47 12.17,24.92 11.13,23.34 10.67,23.19 v9.4,23.16 | v15.95,20.75 14.2,20.75 14.15,20.8 14.15,19.14 v13.56,18.55 12.85,18.55 v12.04,19.37 | v18.83,27.29 19.41,27.24 20.05,27.03 20.37,26.92 20.37,22.06 21.65,20.78 U$1.8 | v13.51,13.63 13.51,10.48 v14.03,9.96
VIN
  Top 0.254: IC1.3 IC1.4 U$8.P$1 U$7.P$1 6.87,8.88 C6.1
VUSB
  Top 0.254: J2.4 10.73,4.88 6.41,4.88 5.98,5.74 U$7.P$2
XPD_DCDC
  Top 0.254: R8.2 9.58,20.75 U$5.P$8
XTAL_IN
  Top 0.254: U$5.P$28 13.01,26.95 Q2.1 11.62,27.29 C9.2
XTAL_OUT
  Top 0.254: U$5.P$27 13.51,27.83 Q2.3 14.25,28.46 C8.1